# EAGLE schematic Sharp IR Distance 2YA02 (EAGLE 9.6.2)
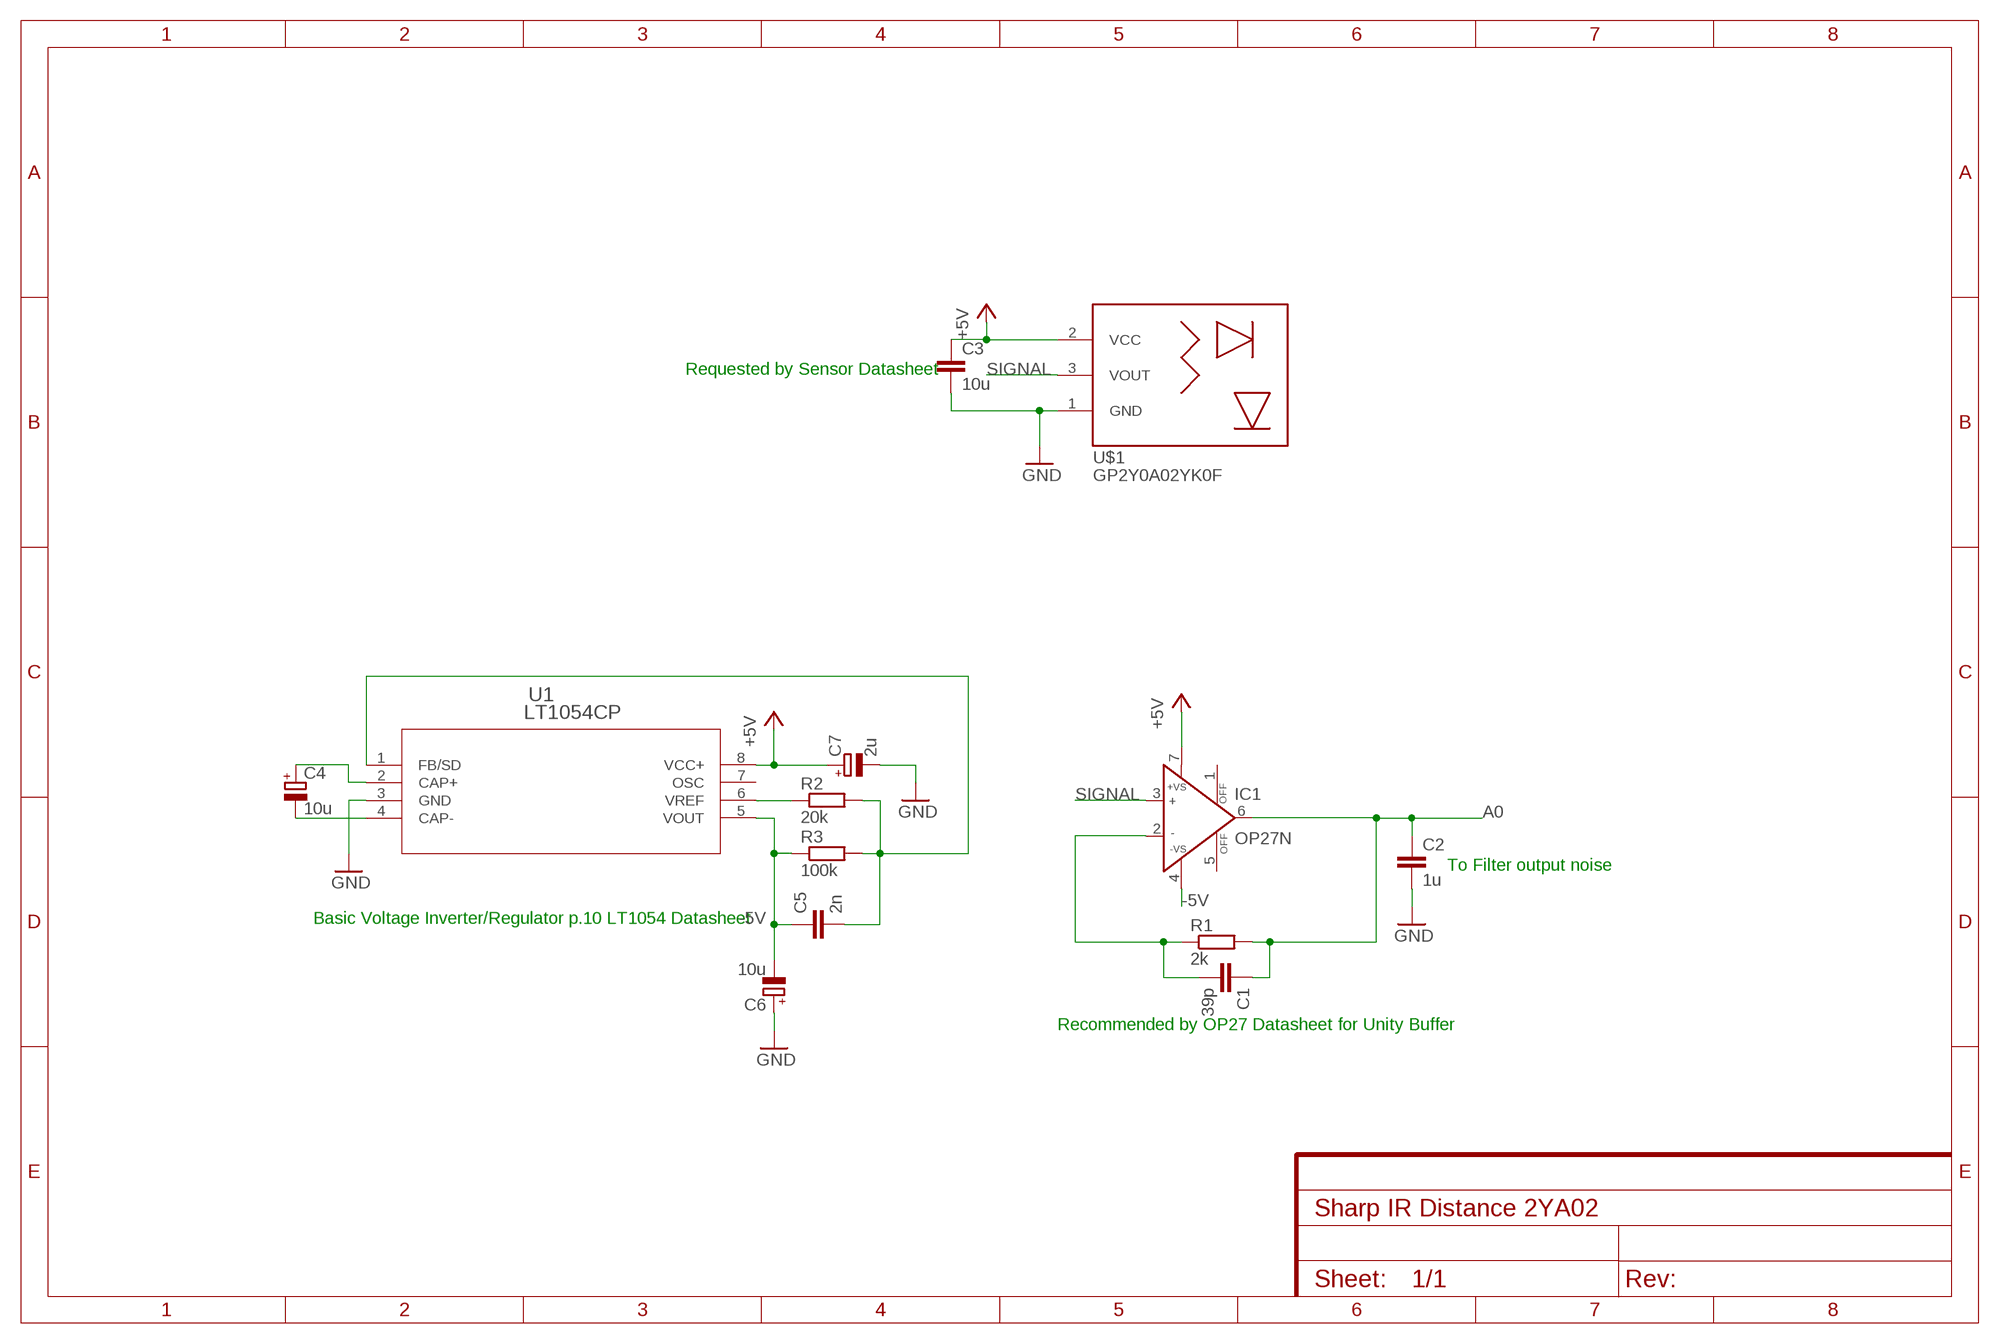
[diagram p0: schematic, sheet 1]

## Parts
C1  39p  C-EU025-024X044  [C025-024X044]
C2  1u  C-EU025-024X044  [C025-024X044]
C3  10u  C-EU025-024X044  [C025-024X044]
C4  10u  CPOL-EUTT2D5  [TT2D5]
C5  2n  C-EU025-024X044  [C025-024X044]
C6  10u  CPOL-EUTT2D5  [TT2D5]
C7  2u  CPOL-EUTT2D5  [TT2D5]
IC1  OP27N  [DIL08]
R1  2k  R-EU_0204/7  [0204/7]
R2  20k  R-EU_0204/7  [0204/7]
R3  100k  R-EU_0204/7  [0204/7]
U1  LT1054CP  [P8]
U$1  GP2Y0A02YK0F  [22-23-2031]

## Nets
+5V: C3.1 C7.+ IC1.7(+VS) U1.8(VCC+) U$1.2(VCC)
-5V: C5.1 C6.- IC1.4(-VS) R3.1 U1.5(VOUT)
A0: C1.1 C2.1 IC1.6(OUT) R1.2
GND: C2.2 C3.2 C6.+ C7.- U1.3(GND) U$1.1(GND)
N$1: C4.+ U1.2(CAP+)
N$2: C1.2 IC1.2(IN-) R1.1
N$3: C4.- U1.4(CAP-)
N$4: R2.1 U1.6(VREF)
N$6: C5.2 R2.2 R3.2 U1.1(FB/SD)
SIGNAL: IC1.3(IN+) U$1.3(VOUT)
Unconnected: IC1.1(OFF) IC1.5(OFF) U1.7(OSC)

## Notes on the sheet
- Requested by Sensor Datasheet
- To Filter output noise
- Basic Voltage Inverter/Regulator p.10 LT1054 Datasheet
- Recommended by OP27 Datasheet for Unity Buffer

## Library data of the parts
C1-C3 C5 = IDP_library:C-EU: CAPACITOR, European symbol; SPICEPREFIX: C
C4 C6 C7 = IDP_library:CPOL-EU: POLARIZED CAPACITOR, European symbol; SPICEPREFIX: C
IC1 = IDP_library:OP27: Precision, Low Cost, High Speed, Op Amp
R1-R3 = IDP_library:R-EU_: RESISTOR, European symbol; SPICEPREFIX: R
U1 = IDP_library:LT1054CP; COPYRIGHT: Copyright (C) 2023 Ultra Librarian. All rights reserved.; MANUFACTURER_PART_NUMBER: LT1054CP; MFR_NAME: Texas Instruments
U$1 = IDP_library:GP2Y0A02YK0F